# Altium schematic sheet CM_ALIM.SchDoc
size Tabloid; SheetNumber: 3; SheetTotal: 14; Size: 11x17; Sheet_Name: CM_ALIM
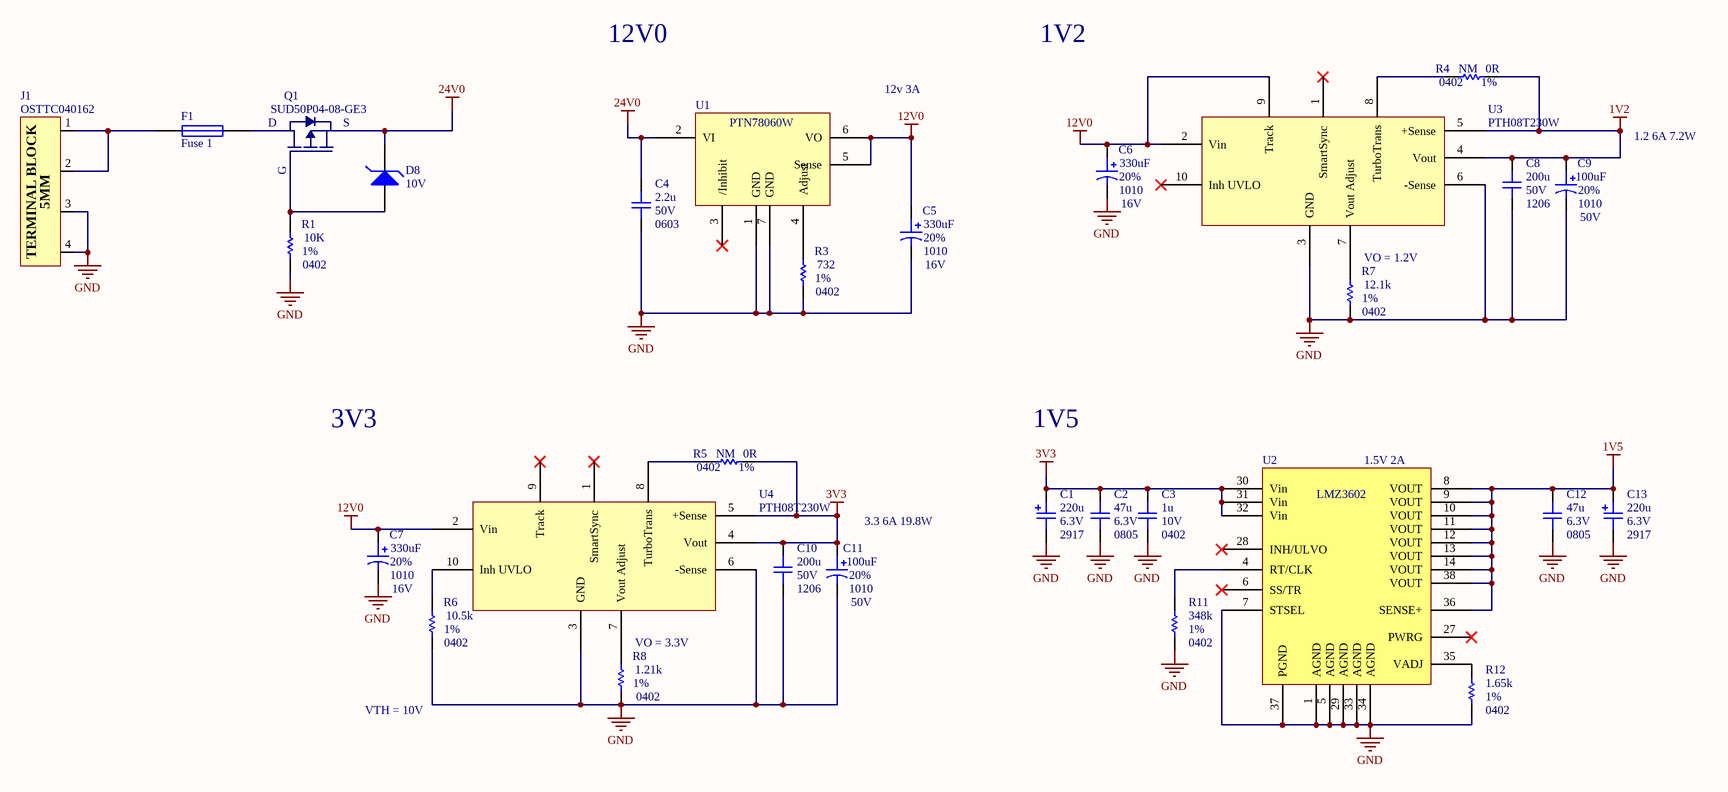
[diagram p0: CM_ALIM.SchDoc]

## Parts
C1  value 220u  Voltage: 6.3V  Package: 2917  [CAP_TAN_2917(D)]  (hidden comment: CAP - TANTALUM - CASE D)
C2  value 47u  Voltage: 6.3V  Package: 0805  [CAP_0805]  (hidden comment: CAP - 0805)
C3  value 1u  Voltage: 10V  Package: 0402  [CAP_0402]  (hidden comment: CAP - 0402)
C4  value 2.2u  Voltage: 50V  Package: 0603  [CAP_0603]  (hidden comment: CAP - 0603)
C5  value 330uF  Voltage: 16V  Package: 1010  Precision: 20%  [CAP_ALU_1010_vishay]  (hidden comment: MAL214699501E3)
C6  value 330uF  Voltage: 16V  Package: 1010  Precision: 20%  [CAP_ALU_1010_vishay]  (hidden comment: MAL214699501E3)
C7  value 330uF  Voltage: 16V  Package: 1010  Precision: 20%  [CAP_ALU_1010_vishay]  (hidden comment: MAL214699501E3)
C8  value 200u  Voltage: 50V  Package: 1206  [CAP_1206]  (hidden comment: CAP - 1206)
C9  value 100uF  Voltage: 50V  Package: 1010  Precision: 20%  [CAP_ALU_1010_vishay]  (hidden comment: MAL215099101E3)
C10  value 200u  Voltage: 50V  Package: 1206  [CAP_1206]  (hidden comment: CAP - 1206)
C11  value 100uF  Voltage: 50V  Package: 1010  Precision: 20%  [CAP_ALU_1010_vishay]  (hidden comment: MAL215099101E3)
C12  value 47u  Voltage: 6.3V  Package: 0805  [CAP_0805]  (hidden comment: CAP - 0805)
C13  value 220u  Voltage: 6.3V  Package: 2917  [CAP_TAN_2917(D)]  (hidden comment: CAP - TANTALUM - CASE D)
D8  Vz: 10V  [SOT23_N]  (hidden comment: ZENER BZX84C10LT1G)
F1  Fuse 1  [PIN-W2/E2.8]
J1  OSTTC040162  [CONN_TERMINAL_OSTTA040161]
Q1  SUD50P04-08-GE3  [TO-252]
R1  value 10K  Package: 0402  Precision: 1%  [RES_0402]  (hidden comment: RES - 0402)
R3  value 732  Package: 0402  Precision: 1%  [RES_0402]  (hidden comment: RES - 0402)
R4  NM  value 0R  Package: 0402  Precision: 1%  [RES_0402]
R5  NM  value 0R  Package: 0402  Precision: 1%  [RES_0402]
R6  value 10.5k  Package: 0402  Precision: 1%  [RES_0402]  (hidden comment: RES - 0402)
R7  value 12.1k  Package: 0402  Precision: 1%  [RES_0402]  (hidden comment: RES - 0402)
R8  value 1.21k  Package: 0402  Precision: 1%  [RES_0402]  (hidden comment: RES - 0402)
R11  value 348k  Package: 0402  Precision: 1%  [RES_0402]  (hidden comment: *)
R12  value 1.65k  Package: 0402  Precision: 1%  [RES_0402]  (hidden comment: *)
U1  PTN78060W  [EUW]
U2  LMZ3602  [RKG39 QFN]
U3  PTH08T230W  [PTH08T230W]
U4  PTH08T230W  [PTH08T230W]

## Nets
1V2: C8.2 C9.1 R4.1 U3.4(Vout) U3.5(+Sense)
1V5: C12.2 C13.2 U2.8(VOUT) U2.9(VOUT) U2.10(VOUT) U2.11(VOUT) U2.12(VOUT) U2.13(VOUT) U2.14(VOUT) U2.36(SENSE+) U2.38(VOUT)
3V3: C1.2 C2.2 C3.2 C10.2 C11.1 R5.1 U2.30(Vin) U2.31(Vin) U2.32(Vin) U4.4(Vout) U4.5(+Sense)
12V0: C5.1 C6.1 C7.1 U1.5(Sense) U1.6(VO) U3.2(Vin) U3.9(Track) U4.2(Vin)
24V0: C4.2 D8.3(K) Q1.S U1.2(VI)
GND: C1.1 C2.1 C3.1 C4.1 C5.2 C6.2 C7.2 C8.1 C9.2 C10.1 C11.2 C12.1 C13.1 J1.3 J1.4 R1.1 R3.1 R6.1 R7.1 R8.1 R11.1 R12.1 U1.1(GND) U1.7(GND) U2.1(AGND) U2.5(AGND) U2.7(STSEL) U2.29(AGND) U2.33(AGND) U2.34(AGND) U2.37(PGND) U3.3(GND) U3.6(-Sense) U4.3(GND) U4.6(-Sense)
NetD8_1: D8.1(A) Q1.G R1.2
NetF1_1: F1.1 J1.1 J1.2
NetF1_2: F1.2 Q1.D
NetR3_2: R3.2 U1.4(Adjust)
NetR4_2: R4.2 U3.8(TurboTrans)
NetR5_2: R5.2 U4.8(TurboTrans)
NetR6_2: R6.2 U4.10(Inh_UVLO)
NetR7_2: R7.2 U3.7(Vout_Adjust)
NetR8_2: R8.2 U4.7(Vout_Adjust)
NetR11_2: R11.2 U2.4(RT/CLK)
NetR12_2: R12.2 U2.35(VADJ)

Not connected (* = marked no-connect by the designer): U1 3(/Inhibit)*; U2 6(SS/TR)* 27(PWRG)* 28(INH/ULVO)*; U3 1(SmartSync)* 10(Inh_UVLO)*; U4 1(SmartSync)* 9(Track)*

## Notes on the sheet
- 12V0
- 1V2
- 12v 3A
- 1.2 6A 7.2W
- VO = 1.2V
- 3V3
- 1V5
- (near U2) 1.5V 2A
- (near C11) 3.3 6A 19.8W
- VO = 3.3V
- VTH = 10V
- Sheet Name
- Project Title
- Global Project
- Size
- Group
- Revision
- Date
- Sheet
- of
- Filename
- Designers
- (in symbol CONN_TERMINAL_OSTTC040162) TERMINAL BLOCK; 5MM

## Library data of the parts
C1 C13 = CAP_TANT_2917(D): CAP - TANTALUM - 2917; Precision: 10%; Current: *; CreatedBy: Jonathan Bouchard; Power: *
C2 C12 = CAP - 0805: Precision: 10%; Current: *; CreatedBy: Jonathan Bouchard; Power: *
C3 = CAP - 0402: Precision: 10%; Current: *; CreatedBy: Jonathan Bouchard; Power: *
C4 = CAP - 0603: Precision: 10%; Current: *; CreatedBy: Jonathan Bouchard; Power: *
C5-C7 = CAP_ALU_MAL214699501E3: CAP - ALU 330uF 20% 16V - 1010; Current: 750mA; Mfg: Vishay Dale; Mfg Part Number: MAL214699501E3; HelpURL: http://www.vishay.com/docs/28403/146cti.pdf; CreatedBy: Jonathan Bouchard; Temperature: -55°C to 125°C; Power: *; Supplier 1: Digikey; Supplier Part Number 1: 4405PHCT-ND
C8 C10 = CAP - 1206: Precision: 10%; Current: *; CreatedBy: Jonathan Bouchard; Power: *
C9 C11 = CAP_ALU_MAL215099101E3: CAP - ALU 100uF 20% 50V - 1010; Current: 490mA; Mfg: Vishay Dale; Mfg Part Number: MAL215099101E3; HelpURL: http://www.vishay.com/docs/28395/150crz.pdf; CreatedBy: Jonathan Bouchard; Temperature: -55°C to 125°C; Power: *; Supplier 1: Digikey; Supplier Part Number 1: 4399PHDKR-ND
D8 = ZENER BZX84C10LT1G: Zener Diode
F1 = Fuse 1: Fuse; Published: 8-Jun-2000; LatestRevisionDate: 17-Jul-2002; LatestRevisionNote: Re-released for DXP Platform.; PackageReference: PIN-W2/E2.8; Publisher: Altium Limited; PackageDescription: Thru-Hole; 2 Leads
J1 = CONN_TERMINAL_OSTTC040162: CONN -  TERMINAL BLOCK 4POS 5MM - TH; Mfg: On Shore Technology Inc.; Voltage: *; Current: *; Power: *; Mfg Part Number: OSTTC040162; HelpURL: http://www.on-shore.com/wp-content/uploads/2015/09/osttcxx0162.pdf; CreatedBy: Jonathan Bouchard; Temperature: -30°C ~ 105°C; Value: *; Precision: *; Package: TH-4; Supplier 1: Digikey; Supplier Part Number 1: ED2602-ND
Q1 = P-MOS SUD50P04-08-GE3: Supplier 1: Mouser; Supplier 2: Allied
R1 R3-R8 R11 R12 = RES - 0402: Voltage: 50V; Power: 1/16W; Current: *; CreatedBy: Jonathan Bouchard
U1 = PTN78060W: Wide input volate regulator; Output Current: 3A
U2 = LMZ3602: 2A Power Module